# Altium schematic sheet 驱动区赛.SchDoc
size A3
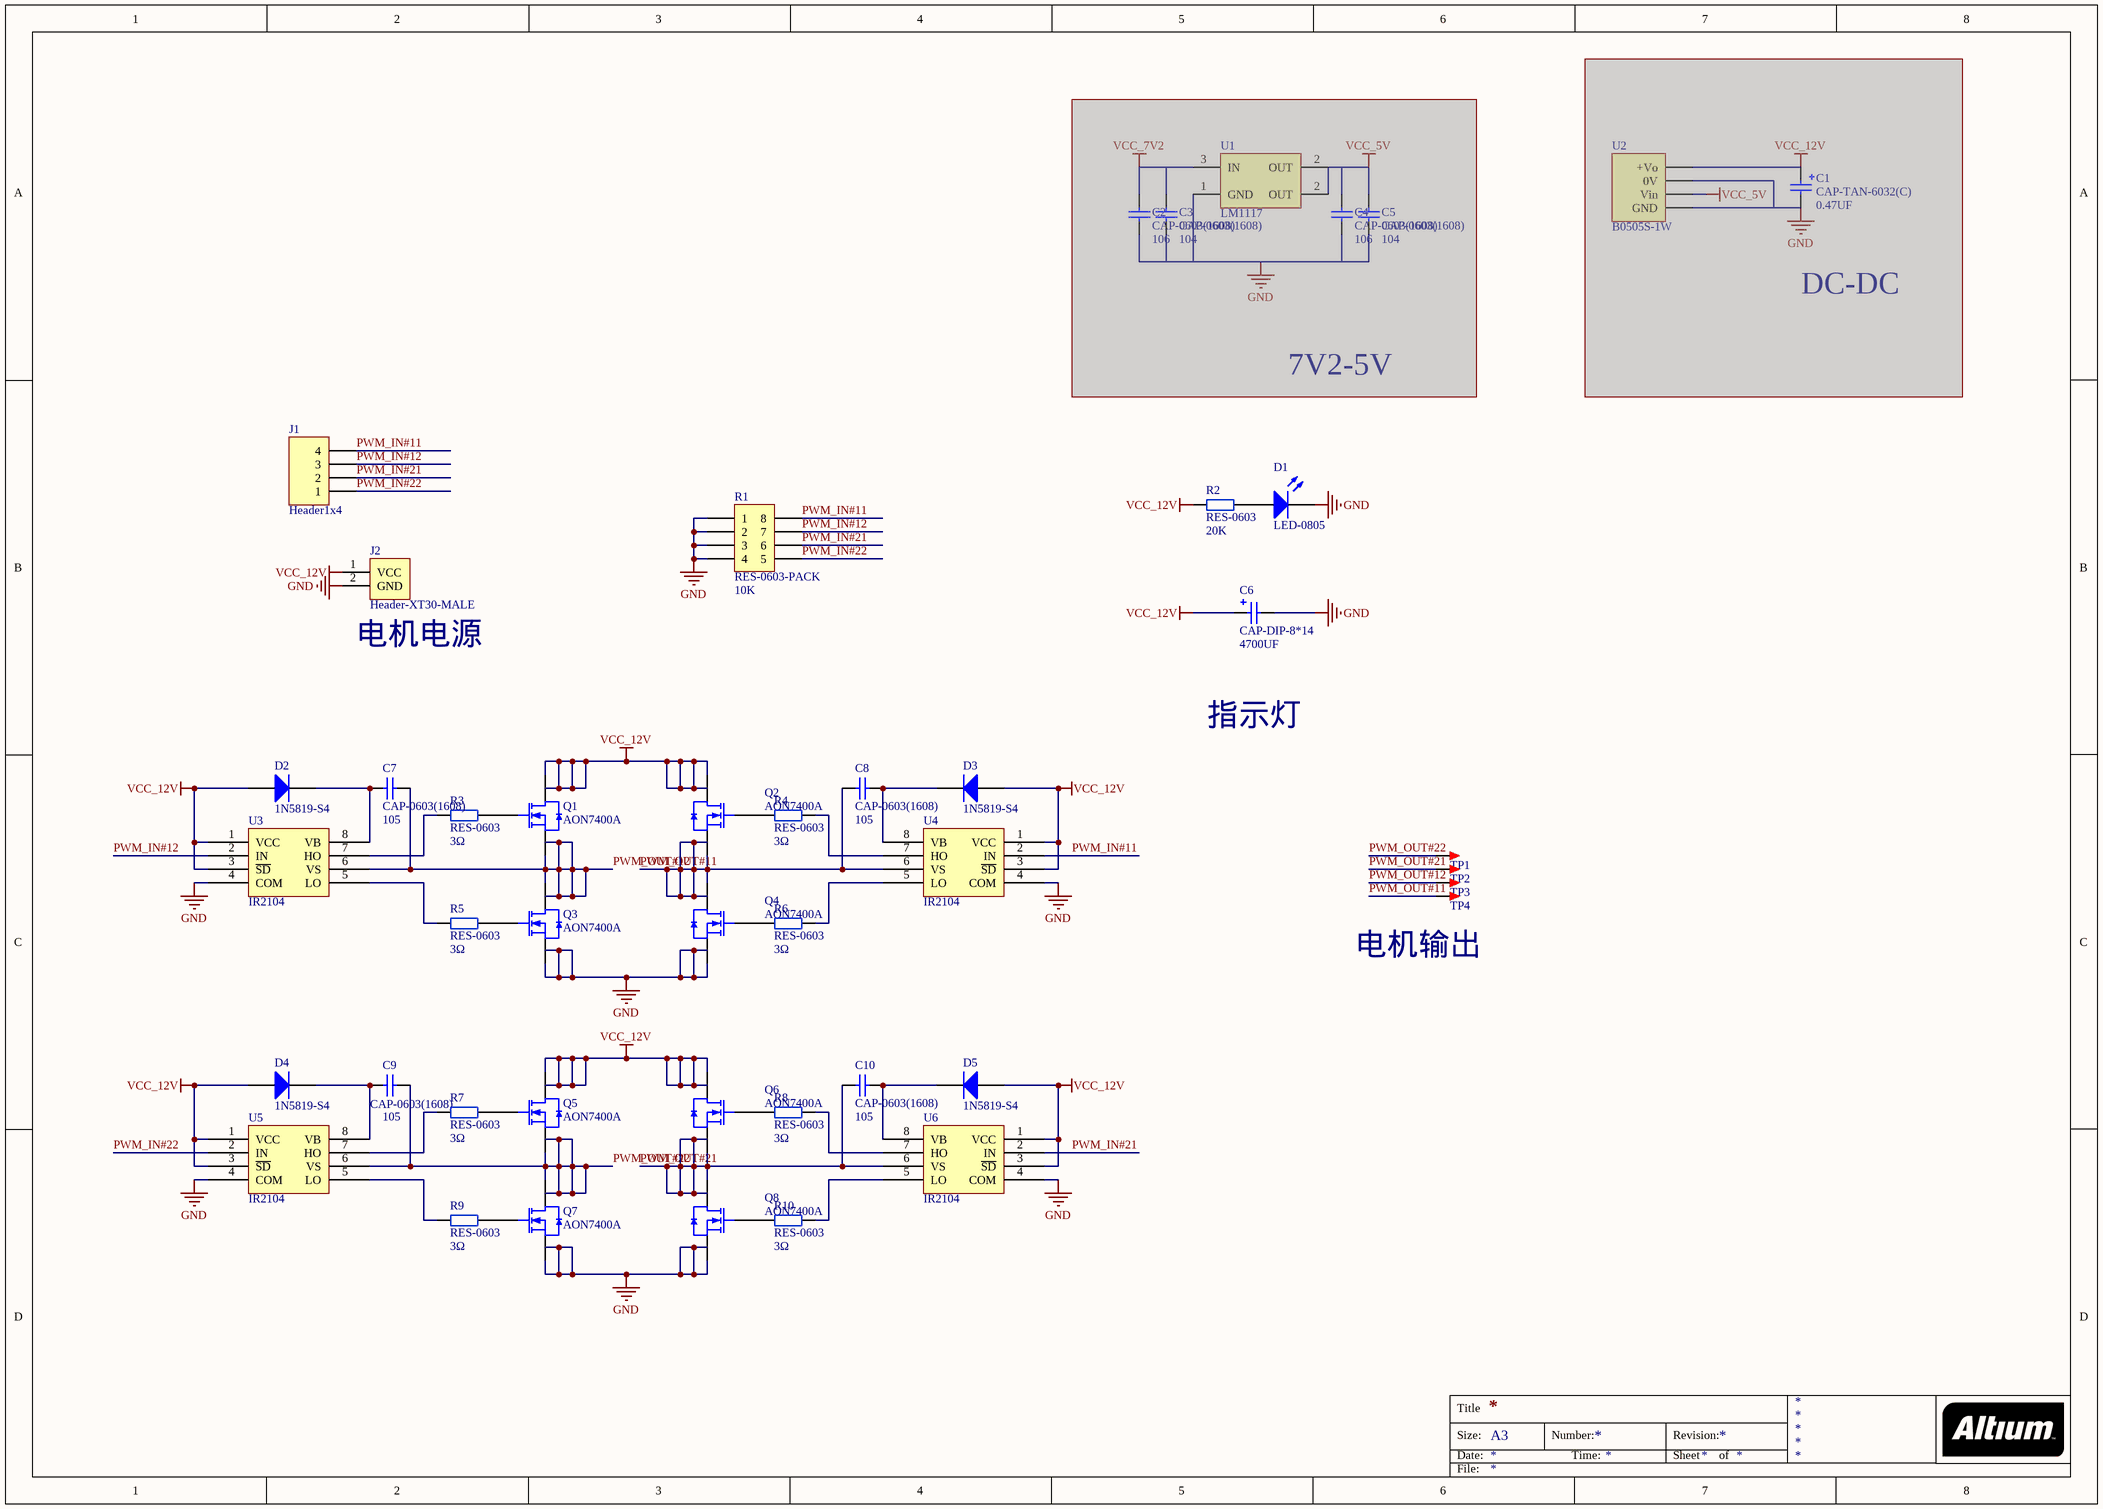
[diagram p0: 驱动区赛.SchDoc]

## Parts
C1  CAP-TAN-6032(C)  [CAP-6032]  (masked out: inside a compile mask, not in the netlist)
C2  CAP-0603(1608)  [C0603]  (masked out: inside a compile mask, not in the netlist)
C3  CAP-0603(1608)  [C0603]  (masked out: inside a compile mask, not in the netlist)
C4  CAP-0603(1608)  [C0603]  (masked out: inside a compile mask, not in the netlist)
C5  CAP-0603(1608)  [C0603]  (masked out: inside a compile mask, not in the netlist)
C6  CAP-DIP-8*14  [CAP-DIP-8X14]
C7  CAP-0603(1608)  [CAP-0603]
C8  CAP-0603(1608)  [CAP-0603]
C9  CAP-0603(1608)  [CAP-0603]
C10  CAP-0603(1608)  [CAP-0603]
D1  LED-0805  [LED-0805]
D2  1N5819-S4  [SOD-214]
D3  1N5819-S4  [SOD-214]
D4  1N5819-S4  [SOD-214]
D5  1N5819-S4  [SOD-214]
J1  Header1x4  [HEADER1X4 - BENT]
J2  Header-XT30-MALE  [HEADER-XT30PW]
Q1  AON7400A  [DFN 3x3]
Q2  AON7400A  [DFN 3x3]
Q3  AON7400A  [DFN 3x3]
Q4  AON7400A  [DFN 3x3]
Q5  AON7400A  [DFN 3x3]
Q6  AON7400A  [DFN 3x3]
Q7  AON7400A  [DFN 3x3]
Q8  AON7400A  [DFN 3x3]
R1  RES-0603-PACK  [RES-0603 - PACK]
R2  RES-0603  [RES-0603]
R3  RES-0603  [RES-0603]
R4  RES-0603  [RES-0603]
R5  RES-0603  [RES-0603]
R6  RES-0603  [RES-0603]
R7  RES-0603  [RES-0603]
R8  RES-0603  [CAP-0603]
R9  RES-0603  [CAP-0603]
R10  RES-0603  [RES-0603]
TP1  TEST  [TEST PAD 1.8]  (value not drawn)
TP2  TEST  [TEST PAD 1.8]  (value not drawn)
TP3  TEST  [TEST PAD 1.8]  (value not drawn)
TP4  TEST  [TEST PAD 1.8]  (value not drawn)
U1  LM1117  [SOT-89]  (masked out: inside a compile mask, not in the netlist)
U2  B0505S-1W  [B_S-1W]  (masked out: inside a compile mask, not in the netlist)
U3  IR2104  [SOP-8]
U4  IR2104  [SOP-8]
U5  IR2104  [SOP-8]
U6  IR2104  [SOP-8]

## Nets
GND: C6.2 D1.2(K) J2.2(GND) Q3.S Q4.S Q7.S Q8.S R1.1 R1.2 R1.3 R1.4 U3.4(COM) U4.4(COM) U5.4(COM) U6.4(COM)
VCC_12V: C6.1 D2.1(A) D3.1(A) D4.1(A) D5.1(A) J2.1(VCC) Q1.D Q2.D Q5.D Q6.D R2.1 U3.1(VCC) U3.3(~{SD}) U4.1(VCC) U4.3(~{SD}) U5.1(VCC) U5.3(~{SD}) U6.1(VCC) U6.3(~{SD})
PWM_IN#11: J1.4 R1.8 U4.2(IN)
PWM_IN#12: J1.3 R1.7 U3.2(IN)
PWM_IN#21: J1.2 R1.6 U6.2(IN)
PWM_IN#22: J1.1 R1.5 U5.2(IN)
PWM_OUT#11: C8.2 Q2.S Q4.D TP4.1 U4.6(VS)
PWM_OUT#12: C7.1 Q1.S Q3.D TP3.1 U3.6(VS)
PWM_OUT#21: C10.2 Q6.S Q8.D TP2.1 U6.6(VS)
PWM_OUT#22: C9.1 Q5.S Q7.D TP1.1 U5.6(VS)
NetC7_2: C7.2 D2.2(K) U3.8(VB)
NetC8_1: C8.1 D3.2(K) U4.8(VB)
NetC9_2: C9.2 D4.2(K) U5.8(VB)
NetC10_1: C10.1 D5.2(K) U6.8(VB)
NetD1_1: D1.1(A) R2.2
NetQ1_G: Q1.G R3.2
NetQ2_G: Q2.G R4.1
NetQ3_G: Q3.G R5.2
NetQ4_G: Q4.G R6.1
NetQ5_G: Q5.G R7.2
NetQ6_G: Q6.G R8.1
NetQ7_G: Q7.G R9.2
NetQ8_G: Q8.G R10.1
NetR3_1: R3.1 U3.7(HO)
NetR4_2: R4.2 U4.7(HO)
NetR5_1: R5.1 U3.5(LO)
NetR6_2: R6.2 U4.5(LO)
NetR7_1: R7.1 U5.7(HO)
NetR8_2: R8.2 U6.7(HO)
NetR9_1: R9.1 U5.5(LO)
NetR10_2: R10.2 U6.5(LO)

## Notes on the sheet
- DC-DC
- 7V2-5V
- (near J2) 电机电源
- 指示灯
- 电机输出
- Title
- Size:
- Date:
- A3
- Number:
- Time:
- Revision:
- Sheet
- of
- File:
- (in symbol CAP-0603(1608)) 106; 104; 105
- (in symbol CAP-DIP-8*14) 4700UF
- (in symbol CAP-TAN-6032(C)) 0.47UF
- (in symbol RES-0603) 20K; 3Ω
- (in symbol RES-0603-PACK) 10K

## Library data of the parts
C1 = CAP-TAN-6032(C): 0.47~220UF
C6 = CAP-DIP-8*14: 100UF
D2-D5 = 1N5819-S4: S4
J2 = Header-XT30-FEMALE: 航模接头
Q1-Q8 = AON7400: NMOS
TP1-TP4 = TEST: 测试点; 版权归属: 源创客; BOM名称: 测试点; 学习资源: www.ooocke.com